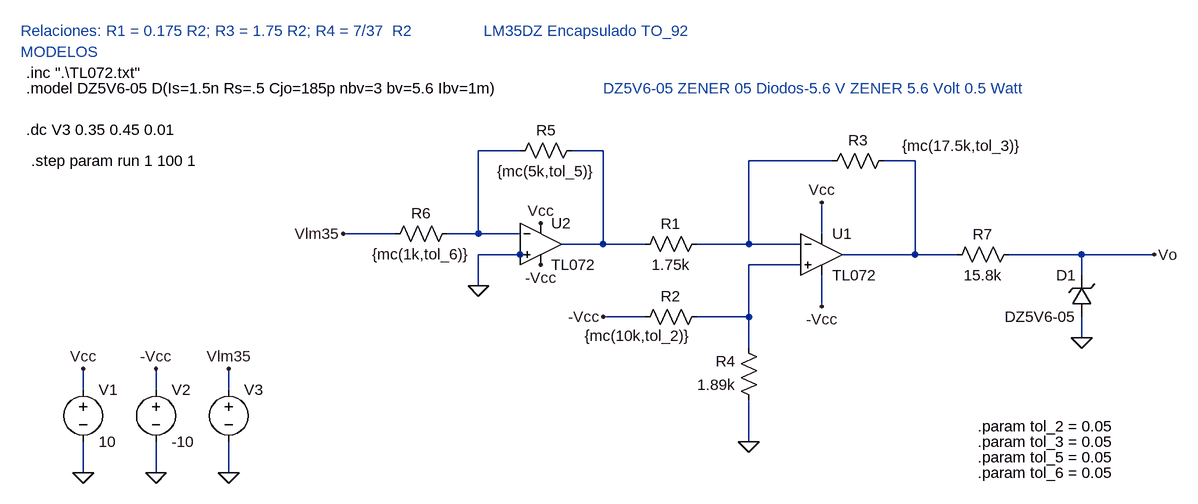
[diagram p0: schematic Modelo-1.asc]
Modelo-1.asc, the LTspice schematic file:
Version 4
SHEET 1 2232 680
WIRE 496 -176 432 -176
WIRE 624 -176 576 -176
WIRE 976 -160 848 -160
WIRE 1104 -160 1056 -160
WIRE 304 -48 224 -48
WIRE 432 -48 432 -176
WIRE 432 -48 384 -48
WIRE 496 -48 432 -48
WIRE 960 -48 960 -96
WIRE 624 -32 624 -176
WIRE 624 -32 560 -32
WIRE 688 -32 624 -32
WIRE 848 -32 848 -160
WIRE 848 -32 768 -32
WIRE 928 -32 848 -32
WIRE 496 -16 432 -16
WIRE 512 -16 496 -16
WIRE 1104 -16 1104 -160
WIRE 1104 -16 992 -16
WIRE 1168 -16 1104 -16
WIRE 1360 -16 1248 -16
WIRE 1472 -16 1360 -16
WIRE 928 0 848 0
WIRE 1360 16 1360 -16
WIRE 432 32 432 -16
WIRE 960 64 960 16
WIRE 688 80 624 80
WIRE 848 80 848 0
WIRE 848 80 768 80
WIRE 1360 112 1360 80
WIRE 848 128 848 80
WIRE -176 192 -176 160
WIRE -64 192 -64 160
WIRE 48 192 48 160
WIRE 848 272 848 208
WIRE -176 320 -176 272
WIRE -64 320 -64 272
WIRE 48 320 48 272
FLAG 224 -48 Vlm35
FLAG 848 272 0
FLAG 1472 -16 Vo
FLAG 960 -96 Vcc
FLAG 960 64 -Vcc
FLAG -64 160 -Vcc
FLAG -176 160 Vcc
FLAG -176 320 0
FLAG -64 320 0
FLAG 48 320 0
FLAG 48 160 Vlm35
FLAG 624 80 -Vcc
FLAG 528 -64 Vcc
FLAG 528 0 -Vcc
FLAG 432 32 0
FLAG 1360 112 0
SYMBOL res 784 -48 R90
WINDOW 0 0 56 VBottom 2
WINDOW 3 32 56 VTop 2
SYMATTR InstName R1
SYMATTR Value 1.75k
SYMBOL res 784 64 R90
WINDOW 0 0 56 VBottom 2
WINDOW 3 29 107 VTop 2
SYMATTR InstName R2
SYMATTR Value {mc(10k,tol_2)}
SYMBOL res 864 224 R180
WINDOW 0 36 76 Left 2
WINDOW 3 36 40 Left 2
SYMATTR InstName R4
SYMATTR Value 1.89k
SYMBOL voltage -176 176 R0
SYMATTR InstName V1
SYMATTR Value 10
SYMBOL voltage -64 176 R0
SYMATTR InstName V2
SYMATTR Value -10
SYMBOL voltage 48 176 R0
WINDOW 123 0 0 Left 0
WINDOW 39 0 0 Left 0
SYMATTR InstName V3
SYMATTR Value ""
SYMBOL res 1072 -176 R90
WINDOW 0 0 56 VBottom 2
WINDOW 3 -23 -104 VTop 2
SYMATTR InstName R3
SYMATTR Value {mc(17.5k,tol_3)}
SYMBOL Opamps\\opamp2 960 -80 R0
SYMATTR InstName U1
SYMATTR Value TL072
SYMBOL Opamps\\opamp2 528 -96 R0
SYMATTR InstName U2
SYMATTR Value TL072
SYMBOL res 592 -192 R90
WINDOW 0 0 56 VBottom 2
WINDOW 3 32 56 VTop 2
SYMATTR InstName R5
SYMATTR Value {mc(5k,tol_5)}
SYMBOL res 400 -64 R90
WINDOW 0 0 56 VBottom 2
WINDOW 3 32 56 VTop 2
SYMATTR InstName R6
SYMATTR Value {mc(1k,tol_6)}
SYMBOL res 1264 -32 R90
WINDOW 0 0 56 VBottom 2
WINDOW 3 32 56 VTop 2
SYMATTR InstName R7
SYMATTR Value 15.8k
SYMBOL zener 1376 80 R180
WINDOW 0 24 64 Left 2
WINDOW 3 24 0 Left 2
SYMATTR InstName D1
SYMATTR Value DZ5V6-05
TEXT -264 -296 Left 2 !.inc ".\\TL072.txt"
TEXT -272 -360 Left 2 ;Relaciones: R1 = 0.175 R2; R3 = 1.75 R2; R4 = 7/37  R2
TEXT -264 -208 Left 2 !.dc V3 0.35 0.45 0.01
TEXT -264 -272 Left 2 !.model DZ5V6-05 D(Is=1.5n Rs=.5 Cjo=185p nbv=3 bv=5.6 Ibv=1m)
TEXT -272 -328 Left 2 ;MODELOS
TEXT 624 -272 Left 2 ;DZ5V6-05 ZENER 05 Diodos-5.6 V ZENER 5.6 Volt 0.5 Watt
TEXT 440 -360 Left 2 ;LM35DZ Encapsulado TO_92
TEXT 1200 320 Left 2 !.param tol_6 = 0.05
TEXT 1200 248 Left 2 !.param tol_2 = 0.05
TEXT 1200 272 Left 2 !.param tol_3 = 0.05
TEXT 1200 296 Left 2 !.param tol_5 = 0.05
TEXT -256 -160 Left 2 !.step param run 1 100 1

The netlist it stands for:
* Modelo-1.asc
R1 N003 N002 1.75k
R2 N005 -Vcc {mc(10k,tol_2)}
R4 0 N005 1.89k
V1 Vcc 0 10
V2 -Vcc 0 -10
V3 Vlm35 0
R3 N004 N003 {mc(17.5k,tol_3)}
XU1 N005 N003 Vcc -Vcc N004 TL072  ; pins In+ In- V+ V- OUT
XU2 0 N001 Vcc -Vcc N002 TL072  ; pins In+ In- V+ V- OUT
R5 N002 N001 {mc(5k,tol_5)}
R6 N001 Vlm35 {mc(1k,tol_6)}
R7 Vo N004 15.8k
D1 0 Vo DZ5V6-05
.model D D
.lib standard.dio
.inc ".\TL072.txt"
* Relaciones: R1 = 0.175 R2; R3 = 1.75 R2; R4 = 7/37  R2
.dc V3 0.35 0.45 0.01
.model DZ5V6-05 D(Is=1.5n Rs=.5 Cjo=185p nbv=3 bv=5.6 Ibv=1m)
* MODELOS
* DZ5V6-05 ZENER 05 Diodos-5.6 V ZENER 5.6 Volt 0.5 Watt
* LM35DZ Encapsulado TO_92
.param tol_6 = 0.05
.param tol_2 = 0.05
.param tol_3 = 0.05
.param tol_5 = 0.05
.step param run 1 100 1
.backanno
.end